# Altium schematic sheet p2_view.SchDoc
size 599 x 299 mm
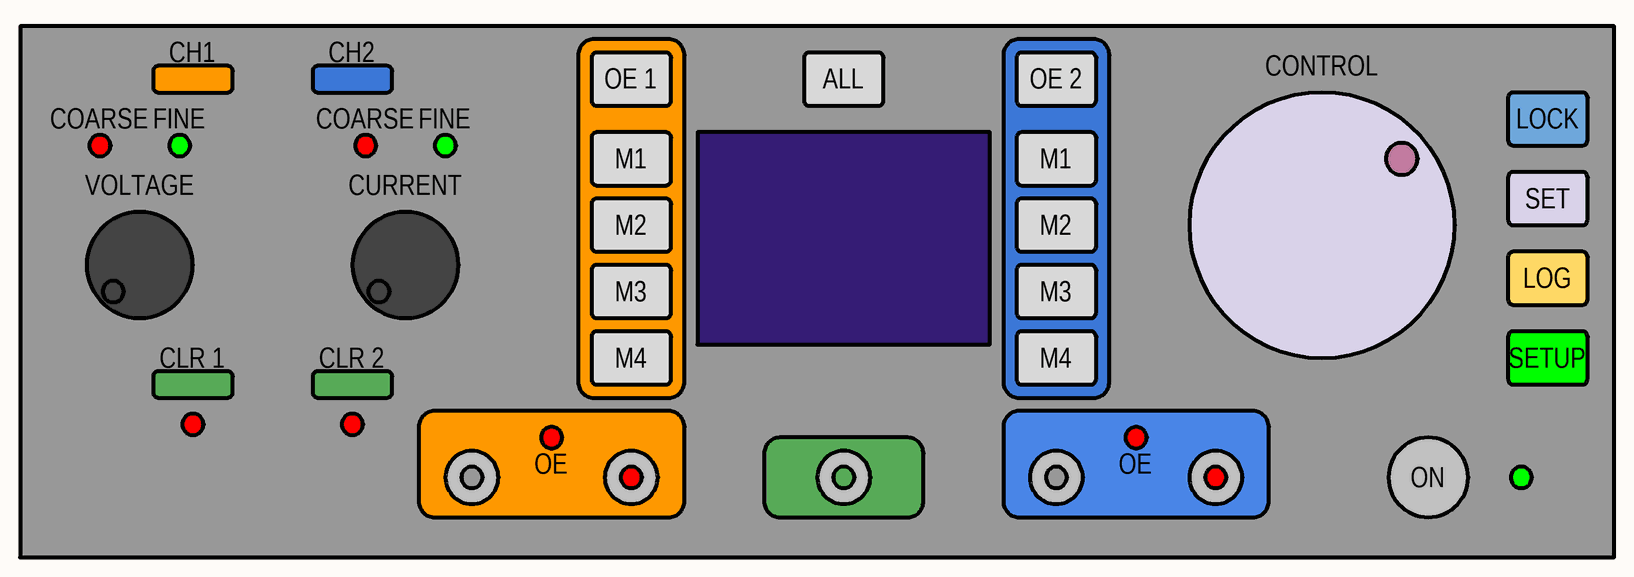
[diagram p0: p2_view.SchDoc]

## Notes on the sheet
- CH1
- CH2
- OE 1
- ALL
- OE 2
- CONTROL
- COARSE
- FINE
- M1
- LOCK
- VOLTAGE
- CURRENT
- M2
- SET
- M3
- LOG
- CLR 1
- CLR 2
- M4
- SETUP
- OE
- ON